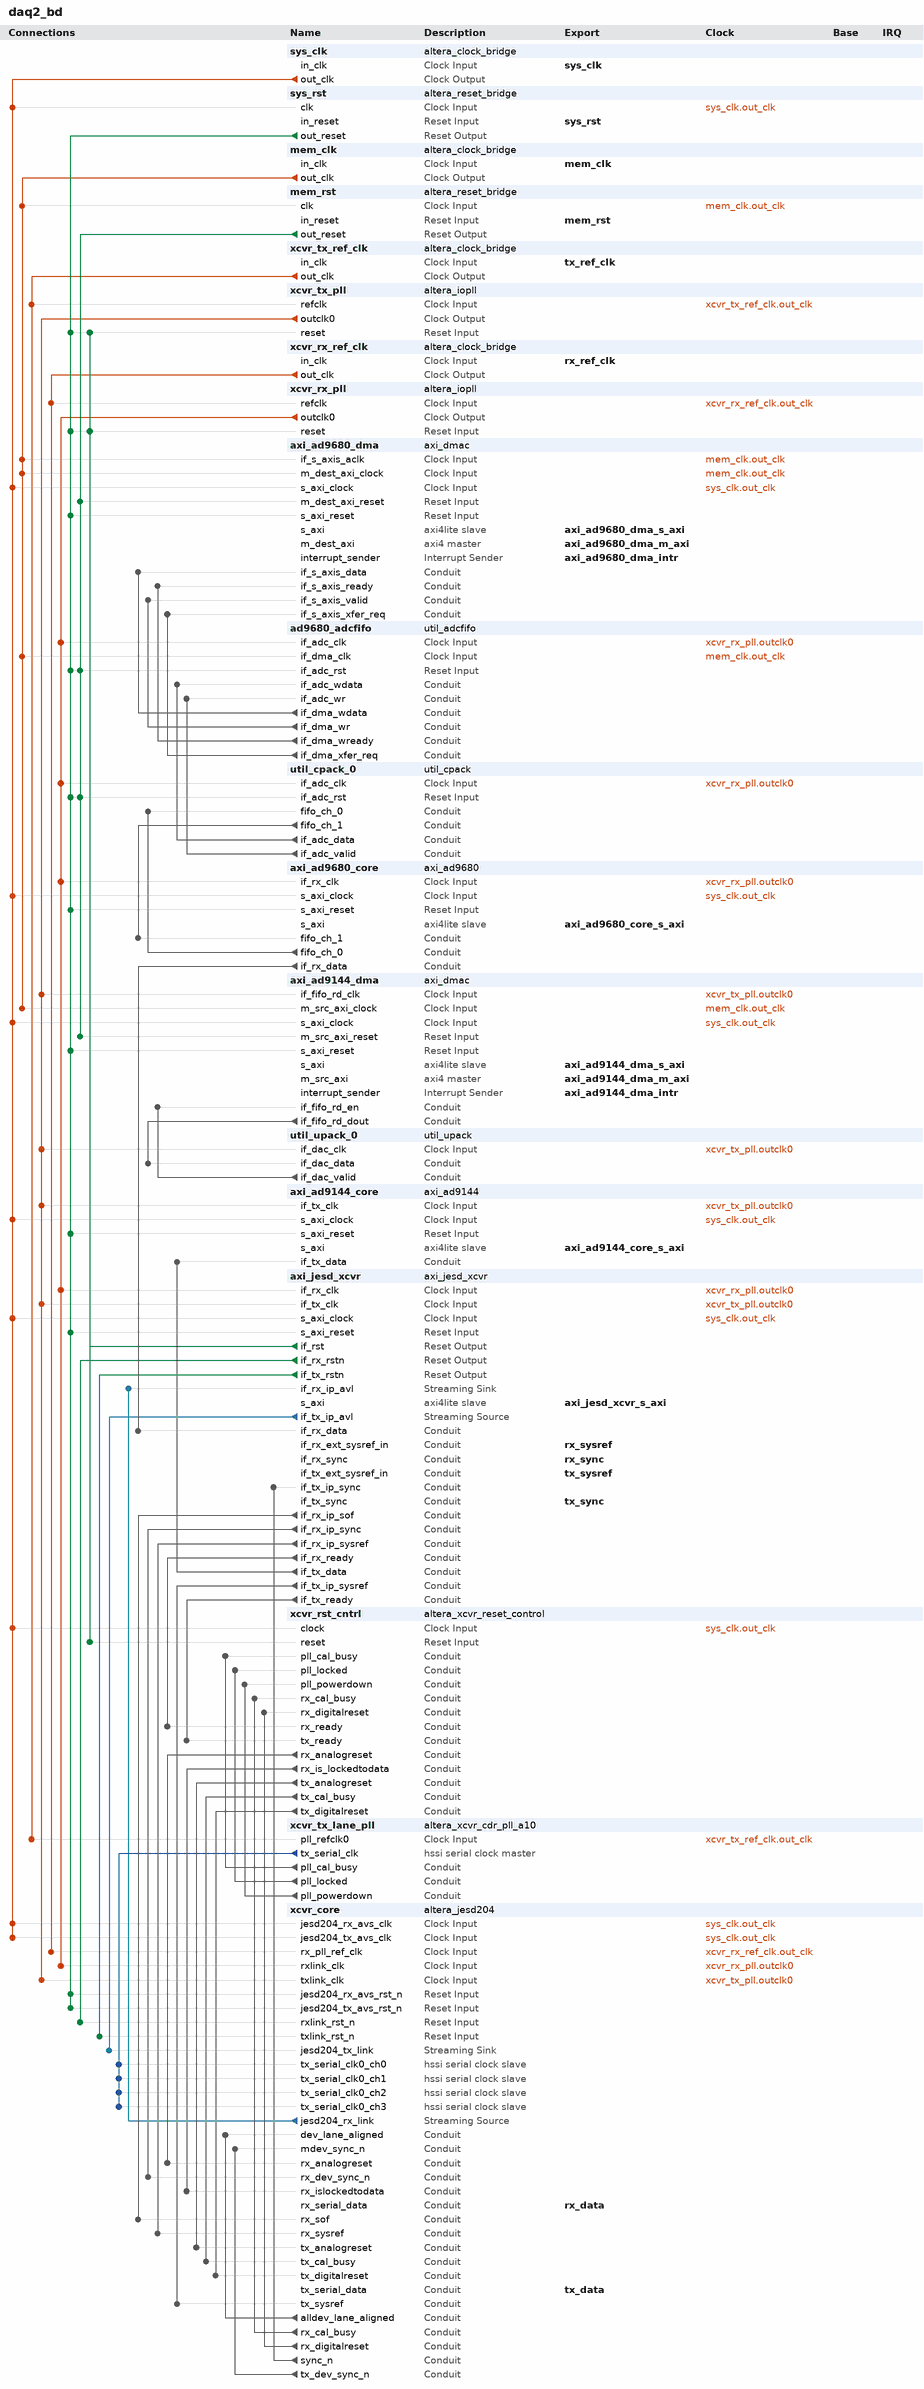
[diagram p0: system contents]
# Platform Designer (Qsys) system daq2_bd, Arria 10 10AX115S2F45I2SG
# Parameters at their usual value, and those the tool derives, are not listed.
package require -exact qsys 15.1
create_system daq2_bd
set_project_property DEVICE_FAMILY {Arria 10}
set_project_property DEVICE 10AX115S2F45I2SG

add_instance sys_clk altera_clock_bridge 15.1
set_instance_parameter_value sys_clk DERIVED_CLOCK_RATE 0
set_instance_parameter_value sys_clk EXPLICIT_CLOCK_RATE 100000000

add_instance sys_rst altera_reset_bridge 15.1
set_instance_parameter_value sys_rst ACTIVE_LOW_RESET 0
set_instance_parameter_value sys_rst SYNCHRONOUS_EDGES deassert

add_instance mem_clk altera_clock_bridge 15.1
set_instance_parameter_value mem_clk DERIVED_CLOCK_RATE 0
set_instance_parameter_value mem_clk EXPLICIT_CLOCK_RATE 125000000

add_instance mem_rst altera_reset_bridge 15.1
set_instance_parameter_value mem_rst ACTIVE_LOW_RESET 0
set_instance_parameter_value mem_rst SYNCHRONOUS_EDGES deassert

add_instance xcvr_tx_ref_clk altera_clock_bridge 15.1
set_instance_parameter_value xcvr_tx_ref_clk DERIVED_CLOCK_RATE 0
set_instance_parameter_value xcvr_tx_ref_clk EXPLICIT_CLOCK_RATE 500000000

add_instance xcvr_tx_pll altera_iopll 15.1
set_instance_parameter_value xcvr_tx_pll gui_actual_duty_cycle0 50.0
set_instance_parameter_value xcvr_tx_pll gui_actual_output_clock_frequency0 100.0
set_instance_parameter_value xcvr_tx_pll gui_actual_phase_shift0 0.0
set_instance_parameter_value xcvr_tx_pll gui_actual_phase_shift_deg0 0.0
set_instance_parameter_value xcvr_tx_pll gui_clock_name_global0 false
set_instance_parameter_value xcvr_tx_pll gui_device_speed_grade 1
set_instance_parameter_value xcvr_tx_pll gui_en_lvds_ports Disabled
set_instance_parameter_value xcvr_tx_pll gui_mif_generate false
set_instance_parameter_value xcvr_tx_pll gui_number_of_clocks 1
set_instance_parameter_value xcvr_tx_pll gui_operation_mode direct
set_instance_parameter_value xcvr_tx_pll gui_output_clock_frequency0 250.0
set_instance_parameter_value xcvr_tx_pll gui_reference_clock_frequency 500.0
set_instance_parameter_value xcvr_tx_pll gui_use_NDFB_modes false
set_instance_parameter_value xcvr_tx_pll gui_use_locked false
set_instance_parameter_value xcvr_tx_pll gui_vco_frequency 600.0
set_instance_parameter_value xcvr_tx_pll system_info_device_component 10AX115S2F45I2SG
set_instance_parameter_value xcvr_tx_pll system_info_device_speed_grade 2
set_instance_parameter_value xcvr_tx_pll system_part_trait_speed_grade 2

add_instance xcvr_rx_ref_clk altera_clock_bridge 15.1
set_instance_parameter_value xcvr_rx_ref_clk DERIVED_CLOCK_RATE 0
set_instance_parameter_value xcvr_rx_ref_clk EXPLICIT_CLOCK_RATE 500000000

add_instance xcvr_rx_pll altera_iopll 15.1
set_instance_parameter_value xcvr_rx_pll gui_actual_duty_cycle0 50.0
set_instance_parameter_value xcvr_rx_pll gui_actual_output_clock_frequency0 100.0
set_instance_parameter_value xcvr_rx_pll gui_actual_phase_shift0 0.0
set_instance_parameter_value xcvr_rx_pll gui_actual_phase_shift_deg0 0.0
set_instance_parameter_value xcvr_rx_pll gui_clock_name_global0 false
set_instance_parameter_value xcvr_rx_pll gui_device_speed_grade 1
set_instance_parameter_value xcvr_rx_pll gui_en_lvds_ports Disabled
set_instance_parameter_value xcvr_rx_pll gui_mif_generate false
set_instance_parameter_value xcvr_rx_pll gui_number_of_clocks 1
set_instance_parameter_value xcvr_rx_pll gui_operation_mode direct
set_instance_parameter_value xcvr_rx_pll gui_output_clock_frequency0 250.0
set_instance_parameter_value xcvr_rx_pll gui_reference_clock_frequency 500.0
set_instance_parameter_value xcvr_rx_pll gui_use_NDFB_modes false
set_instance_parameter_value xcvr_rx_pll gui_use_locked false
set_instance_parameter_value xcvr_rx_pll gui_vco_frequency 600.0
set_instance_parameter_value xcvr_rx_pll system_info_device_component 10AX115S2F45I2SG
set_instance_parameter_value xcvr_rx_pll system_info_device_speed_grade 2
set_instance_parameter_value xcvr_rx_pll system_part_trait_speed_grade 2

add_instance axi_ad9680_dma axi_dmac 1.0
set_instance_parameter_value axi_ad9680_dma ASYNC_CLK_DEST_REQ 1
set_instance_parameter_value axi_ad9680_dma ASYNC_CLK_REQ_SRC 1
set_instance_parameter_value axi_ad9680_dma ASYNC_CLK_SRC_DEST 1
set_instance_parameter_value axi_ad9680_dma AXI_SLICE_DEST 0
set_instance_parameter_value axi_ad9680_dma AXI_SLICE_SRC 0
set_instance_parameter_value axi_ad9680_dma CYCLIC 0
set_instance_parameter_value axi_ad9680_dma DMA_2D_TRANSFER 0
set_instance_parameter_value axi_ad9680_dma DMA_DATA_WIDTH_DEST 128
set_instance_parameter_value axi_ad9680_dma DMA_DATA_WIDTH_SRC 128
set_instance_parameter_value axi_ad9680_dma DMA_LENGTH_WIDTH 24
set_instance_parameter_value axi_ad9680_dma DMA_TYPE_DEST 0
set_instance_parameter_value axi_ad9680_dma DMA_TYPE_SRC 1
set_instance_parameter_value axi_ad9680_dma FIFO_SIZE 4
set_instance_parameter_value axi_ad9680_dma ID 0
set_instance_parameter_value axi_ad9680_dma SYNC_TRANSFER_START 1

add_instance ad9680_adcfifo util_adcfifo 1.0
set_instance_parameter_value ad9680_adcfifo ADC_DATA_WIDTH 128
set_instance_parameter_value ad9680_adcfifo DMA_ADDRESS_WIDTH 16
set_instance_parameter_value ad9680_adcfifo DMA_DATA_WIDTH 128
set_instance_parameter_value ad9680_adcfifo DMA_READY_ENABLE 1

add_instance util_cpack_0 util_cpack 1.0
set_instance_parameter_value util_cpack_0 CHANNEL_DATA_WIDTH 64
set_instance_parameter_value util_cpack_0 NUM_OF_CHANNELS 2

add_instance axi_ad9680_core axi_ad9680 1.0
set_instance_parameter_value axi_ad9680_core ID 0

add_instance axi_ad9144_dma axi_dmac 1.0
set_instance_parameter_value axi_ad9144_dma ASYNC_CLK_DEST_REQ 1
set_instance_parameter_value axi_ad9144_dma ASYNC_CLK_REQ_SRC 1
set_instance_parameter_value axi_ad9144_dma ASYNC_CLK_SRC_DEST 1
set_instance_parameter_value axi_ad9144_dma AXI_SLICE_DEST 0
set_instance_parameter_value axi_ad9144_dma AXI_SLICE_SRC 0
set_instance_parameter_value axi_ad9144_dma CYCLIC 1
set_instance_parameter_value axi_ad9144_dma DMA_2D_TRANSFER 0
set_instance_parameter_value axi_ad9144_dma DMA_DATA_WIDTH_DEST 128
set_instance_parameter_value axi_ad9144_dma DMA_DATA_WIDTH_SRC 128
set_instance_parameter_value axi_ad9144_dma DMA_LENGTH_WIDTH 14
set_instance_parameter_value axi_ad9144_dma DMA_TYPE_DEST 2
set_instance_parameter_value axi_ad9144_dma DMA_TYPE_SRC 0
set_instance_parameter_value axi_ad9144_dma FIFO_SIZE 4
set_instance_parameter_value axi_ad9144_dma ID 0
set_instance_parameter_value axi_ad9144_dma SYNC_TRANSFER_START 0

add_instance util_upack_0 util_upack 1.0
set_instance_parameter_value util_upack_0 CHANNEL_DATA_WIDTH 64
set_instance_parameter_value util_upack_0 NUM_OF_CHANNELS 2

add_instance axi_ad9144_core axi_ad9144 1.0
set_instance_parameter_value axi_ad9144_core ID 0
set_instance_parameter_value axi_ad9144_core QUAD_OR_DUAL_N 0

add_instance axi_jesd_xcvr axi_jesd_xcvr 1.0
set_instance_parameter_value axi_jesd_xcvr DEVICE_TYPE 0
set_instance_parameter_value axi_jesd_xcvr ID 0
set_instance_parameter_value axi_jesd_xcvr RX_NUM_OF_LANES 4
set_instance_parameter_value axi_jesd_xcvr TX_NUM_OF_LANES 4

add_instance xcvr_rst_cntrl altera_xcvr_reset_control 15.1
set_instance_parameter_value xcvr_rst_cntrl CHANNELS 4
set_instance_parameter_value xcvr_rst_cntrl RX_PER_CHANNEL 1
set_instance_parameter_value xcvr_rst_cntrl SYS_CLK_IN_MHZ 100
set_instance_parameter_value xcvr_rst_cntrl TX_PER_CHANNEL 1
set_instance_parameter_value xcvr_rst_cntrl TX_PLL_ENABLE 1
set_instance_parameter_value xcvr_rst_cntrl T_PLL_LOCK_HYST 1000
set_instance_parameter_value xcvr_rst_cntrl T_RX_ANALOGRESET 100000
set_instance_parameter_value xcvr_rst_cntrl T_RX_DIGITALRESET 100000
set_instance_parameter_value xcvr_rst_cntrl T_TX_ANALOGRESET 100000
set_instance_parameter_value xcvr_rst_cntrl T_TX_DIGITALRESET 100000
set_instance_parameter_value xcvr_rst_cntrl gui_pll_cal_busy 1

add_instance xcvr_tx_lane_pll altera_xcvr_cdr_pll_a10 15.1
set_instance_parameter_value xcvr_tx_lane_pll base_device NIGHTFURY5
set_instance_parameter_value xcvr_tx_lane_pll bw_sel Medium
set_instance_parameter_value xcvr_tx_lane_pll cdr_pll_cgb_div 1
set_instance_parameter_value xcvr_tx_lane_pll cdr_pll_initial_settings true
set_instance_parameter_value xcvr_tx_lane_pll cdr_pll_is_cascaded_pll false
set_instance_parameter_value xcvr_tx_lane_pll cdr_pll_optimal false
set_instance_parameter_value xcvr_tx_lane_pll device_family {Arria 10}
set_instance_parameter_value xcvr_tx_lane_pll diag_loopback_enable false
set_instance_parameter_value xcvr_tx_lane_pll enable_analog_resets 0
set_instance_parameter_value xcvr_tx_lane_pll enable_pll_reconfig 0
set_instance_parameter_value xcvr_tx_lane_pll generate_add_hdl_instance_example 0
set_instance_parameter_value xcvr_tx_lane_pll generate_docs 1
set_instance_parameter_value xcvr_tx_lane_pll gui_tx_pll_prot_mode Basic
set_instance_parameter_value xcvr_tx_lane_pll message_level error
set_instance_parameter_value xcvr_tx_lane_pll output_clock_frequency 5000
set_instance_parameter_value xcvr_tx_lane_pll rcfg_debug 0
set_instance_parameter_value xcvr_tx_lane_pll rcfg_enable_avmm_busy_port 0
set_instance_parameter_value xcvr_tx_lane_pll rcfg_file_prefix altera_xcvr_cdr_pll_a10
set_instance_parameter_value xcvr_tx_lane_pll rcfg_h_file_enable 0
set_instance_parameter_value xcvr_tx_lane_pll rcfg_jtag_enable 0
set_instance_parameter_value xcvr_tx_lane_pll rcfg_mif_file_enable 0
set_instance_parameter_value xcvr_tx_lane_pll rcfg_multi_enable 0
set_instance_parameter_value xcvr_tx_lane_pll rcfg_profile_cnt 2
set_instance_parameter_value xcvr_tx_lane_pll rcfg_profile_select 1
set_instance_parameter_value xcvr_tx_lane_pll rcfg_separate_avmm_busy 0
set_instance_parameter_value xcvr_tx_lane_pll rcfg_sv_file_enable 0
set_instance_parameter_value xcvr_tx_lane_pll rcfg_txt_file_enable 0
set_instance_parameter_value xcvr_tx_lane_pll refclk_cnt 1
set_instance_parameter_value xcvr_tx_lane_pll refclk_index 0
set_instance_parameter_value xcvr_tx_lane_pll refclk_select_mux_powerdown_mode powerup
set_instance_parameter_value xcvr_tx_lane_pll reference_clock_frequency 500.0
set_instance_parameter_value xcvr_tx_lane_pll select_manual_config false
set_instance_parameter_value xcvr_tx_lane_pll set_altera_xcvr_cdr_pll_a10_calibration_en 1
set_instance_parameter_value xcvr_tx_lane_pll set_capability_reg_enable 0
set_instance_parameter_value xcvr_tx_lane_pll set_csr_soft_logic_enable 0
set_instance_parameter_value xcvr_tx_lane_pll set_user_identifier 0
set_instance_parameter_value xcvr_tx_lane_pll support_mode user_mode

add_instance xcvr_core altera_jesd204 15.1
set_instance_parameter_value xcvr_core ADJCNT 0
set_instance_parameter_value xcvr_core ADJDIR 0
set_instance_parameter_value xcvr_core BID 0
set_instance_parameter_value xcvr_core CF 0
set_instance_parameter_value xcvr_core CS 0
set_instance_parameter_value xcvr_core DATA_PATH RX_TX
set_instance_parameter_value xcvr_core DID 0
set_instance_parameter_value xcvr_core DLB_TEST 0
set_instance_parameter_value xcvr_core ECC_EN 0
set_instance_parameter_value xcvr_core ED_DEV_KIT NONE
set_instance_parameter_value xcvr_core ED_FILESET_SIM false
set_instance_parameter_value xcvr_core ED_FILESET_SYNTH false
set_instance_parameter_value xcvr_core ED_GENERIC_5SERIES No
set_instance_parameter_value xcvr_core ED_GENERIC_A10 No
set_instance_parameter_value xcvr_core ED_HDL_FORMAT_SIM VERILOG
set_instance_parameter_value xcvr_core ED_HDL_FORMAT_SYNTH VERILOG
set_instance_parameter_value xcvr_core GUI_CFG_F 1
set_instance_parameter_value xcvr_core GUI_EN_CFG_F true
set_instance_parameter_value xcvr_core HD 1
set_instance_parameter_value xcvr_core JESDV 1
set_instance_parameter_value xcvr_core K 32
set_instance_parameter_value xcvr_core L 4
set_instance_parameter_value xcvr_core LID0 0
set_instance_parameter_value xcvr_core LID1 1
set_instance_parameter_value xcvr_core LID2 2
set_instance_parameter_value xcvr_core LID3 3
set_instance_parameter_value xcvr_core LID4 4
set_instance_parameter_value xcvr_core LID5 5
set_instance_parameter_value xcvr_core LID6 6
set_instance_parameter_value xcvr_core LID7 7
set_instance_parameter_value xcvr_core M 2
set_instance_parameter_value xcvr_core N 16
set_instance_parameter_value xcvr_core N_PRIME 16
set_instance_parameter_value xcvr_core OPTIMIZE 0
set_instance_parameter_value xcvr_core PCS_CONFIG JESD_PCS_CFG2
set_instance_parameter_value xcvr_core PHADJ 0
set_instance_parameter_value xcvr_core REFCLK_FREQ 500.0
set_instance_parameter_value xcvr_core RES1 0
set_instance_parameter_value xcvr_core RES2 0
set_instance_parameter_value xcvr_core S 1
set_instance_parameter_value xcvr_core SCR 1
set_instance_parameter_value xcvr_core SUBCLASSV 1
set_instance_parameter_value xcvr_core TERMINATE_RECONFIG_EN false
set_instance_parameter_value xcvr_core TEST_COMPONENTS_EN false
set_instance_parameter_value xcvr_core bitrev_en false
set_instance_parameter_value xcvr_core bonded_mode non_bonded
set_instance_parameter_value xcvr_core lane_rate 10000.0
set_instance_parameter_value xcvr_core part_trait_bd NIGHTFURY5
set_instance_parameter_value xcvr_core part_trait_dp 10AX115S2F45I2SG
set_instance_parameter_value xcvr_core pll_reconfig_enable false
set_instance_parameter_value xcvr_core pll_type CMU
set_instance_parameter_value xcvr_core rcfg_jtag_enable false
set_instance_parameter_value xcvr_core sdc_constraint 1.0
set_instance_parameter_value xcvr_core set_capability_reg_enable false
set_instance_parameter_value xcvr_core set_csr_soft_logic_enable false
set_instance_parameter_value xcvr_core set_prbs_soft_logic_enable false
set_instance_parameter_value xcvr_core set_user_identifier 0
set_instance_parameter_value xcvr_core wrapper_opt base_phy

# connections
add_connection mem_clk.out_clk ad9680_adcfifo.if_dma_clk clock
add_connection mem_clk.out_clk axi_ad9144_dma.m_src_axi_clock clock
add_connection mem_clk.out_clk axi_ad9680_dma.if_s_axis_aclk clock
add_connection mem_clk.out_clk axi_ad9680_dma.m_dest_axi_clock clock
add_connection mem_clk.out_clk mem_rst.clk clock
add_connection sys_clk.out_clk axi_ad9144_core.s_axi_clock clock
add_connection sys_clk.out_clk axi_ad9144_dma.s_axi_clock clock
add_connection sys_clk.out_clk axi_ad9680_core.s_axi_clock clock
add_connection sys_clk.out_clk axi_ad9680_dma.s_axi_clock clock
add_connection sys_clk.out_clk axi_jesd_xcvr.s_axi_clock clock
add_connection sys_clk.out_clk sys_rst.clk clock
add_connection sys_clk.out_clk xcvr_core.jesd204_rx_avs_clk clock
add_connection sys_clk.out_clk xcvr_core.jesd204_tx_avs_clk clock
add_connection sys_clk.out_clk xcvr_rst_cntrl.clock clock
add_connection xcvr_rx_pll.outclk0 ad9680_adcfifo.if_adc_clk clock
add_connection xcvr_rx_pll.outclk0 axi_ad9680_core.if_rx_clk clock
add_connection xcvr_rx_pll.outclk0 axi_jesd_xcvr.if_rx_clk clock
add_connection xcvr_rx_pll.outclk0 util_cpack_0.if_adc_clk clock
add_connection xcvr_rx_pll.outclk0 xcvr_core.rxlink_clk clock
add_connection xcvr_rx_ref_clk.out_clk xcvr_core.rx_pll_ref_clk clock
add_connection xcvr_rx_ref_clk.out_clk xcvr_rx_pll.refclk clock
add_connection xcvr_tx_pll.outclk0 axi_ad9144_core.if_tx_clk clock
add_connection xcvr_tx_pll.outclk0 axi_ad9144_dma.if_fifo_rd_clk clock
add_connection xcvr_tx_pll.outclk0 axi_jesd_xcvr.if_tx_clk clock
add_connection xcvr_tx_pll.outclk0 util_upack_0.if_dac_clk clock
add_connection xcvr_tx_pll.outclk0 xcvr_core.txlink_clk clock
add_connection xcvr_tx_ref_clk.out_clk xcvr_tx_lane_pll.pll_refclk0 clock
add_connection xcvr_tx_ref_clk.out_clk xcvr_tx_pll.refclk clock
add_connection axi_jesd_xcvr.if_rst xcvr_rst_cntrl.reset reset
add_connection axi_jesd_xcvr.if_rst xcvr_rx_pll.reset reset
add_connection axi_jesd_xcvr.if_rst xcvr_tx_pll.reset reset
add_connection axi_jesd_xcvr.if_rx_rstn xcvr_core.rxlink_rst_n reset
add_connection axi_jesd_xcvr.if_tx_rstn xcvr_core.txlink_rst_n reset
add_connection mem_rst.out_reset ad9680_adcfifo.if_adc_rst reset
add_connection mem_rst.out_reset axi_ad9144_dma.m_src_axi_reset reset
add_connection mem_rst.out_reset axi_ad9680_dma.m_dest_axi_reset reset
add_connection mem_rst.out_reset util_cpack_0.if_adc_rst reset
add_connection sys_rst.out_reset ad9680_adcfifo.if_adc_rst reset
add_connection sys_rst.out_reset axi_ad9144_core.s_axi_reset reset
add_connection sys_rst.out_reset axi_ad9144_dma.s_axi_reset reset
add_connection sys_rst.out_reset axi_ad9680_core.s_axi_reset reset
add_connection sys_rst.out_reset axi_ad9680_dma.s_axi_reset reset
add_connection sys_rst.out_reset axi_jesd_xcvr.s_axi_reset reset
add_connection sys_rst.out_reset util_cpack_0.if_adc_rst reset
add_connection sys_rst.out_reset xcvr_core.jesd204_rx_avs_rst_n reset
add_connection sys_rst.out_reset xcvr_core.jesd204_tx_avs_rst_n reset
add_connection sys_rst.out_reset xcvr_rx_pll.reset reset
add_connection sys_rst.out_reset xcvr_tx_pll.reset reset
add_connection axi_jesd_xcvr.if_tx_ip_avl xcvr_core.jesd204_tx_link avalon_streaming
add_connection xcvr_core.jesd204_rx_link axi_jesd_xcvr.if_rx_ip_avl avalon_streaming
add_connection ad9680_adcfifo.if_dma_wdata axi_ad9680_dma.if_s_axis_data conduit
add_connection ad9680_adcfifo.if_dma_wr axi_ad9680_dma.if_s_axis_valid conduit
add_connection ad9680_adcfifo.if_dma_wready axi_ad9680_dma.if_s_axis_ready conduit
add_connection ad9680_adcfifo.if_dma_xfer_req axi_ad9680_dma.if_s_axis_xfer_req conduit
add_connection axi_ad9144_dma.if_fifo_rd_dout util_upack_0.if_dac_data conduit
add_connection axi_ad9680_core.fifo_ch_0 util_cpack_0.fifo_ch_0 conduit
add_connection axi_ad9680_core.if_rx_data axi_jesd_xcvr.if_rx_data conduit
add_connection axi_jesd_xcvr.if_rx_ip_sof xcvr_core.rx_sof conduit
add_connection axi_jesd_xcvr.if_rx_ip_sync xcvr_core.rx_dev_sync_n conduit
add_connection axi_jesd_xcvr.if_rx_ip_sysref xcvr_core.rx_sysref conduit
add_connection axi_jesd_xcvr.if_rx_ready xcvr_rst_cntrl.rx_ready conduit
add_connection axi_jesd_xcvr.if_tx_data axi_ad9144_core.if_tx_data conduit
add_connection axi_jesd_xcvr.if_tx_ip_sysref xcvr_core.tx_sysref conduit
add_connection axi_jesd_xcvr.if_tx_ready xcvr_rst_cntrl.tx_ready conduit
add_connection util_cpack_0.fifo_ch_1 axi_ad9680_core.fifo_ch_1 conduit
add_connection util_cpack_0.if_adc_data ad9680_adcfifo.if_adc_wdata conduit
add_connection util_cpack_0.if_adc_valid ad9680_adcfifo.if_adc_wr conduit
add_connection util_upack_0.if_dac_valid axi_ad9144_dma.if_fifo_rd_en conduit
add_connection xcvr_core.alldev_lane_aligned xcvr_core.dev_lane_aligned conduit
add_connection xcvr_core.rx_cal_busy xcvr_rst_cntrl.rx_cal_busy conduit
add_connection xcvr_core.rx_digitalreset xcvr_rst_cntrl.rx_digitalreset conduit
add_connection xcvr_core.sync_n axi_jesd_xcvr.if_tx_ip_sync conduit
add_connection xcvr_core.tx_dev_sync_n xcvr_core.mdev_sync_n conduit
add_connection xcvr_rst_cntrl.rx_analogreset xcvr_core.rx_analogreset conduit
add_connection xcvr_rst_cntrl.rx_is_lockedtodata xcvr_core.rx_islockedtodata conduit
add_connection xcvr_rst_cntrl.tx_analogreset xcvr_core.tx_analogreset conduit
add_connection xcvr_rst_cntrl.tx_cal_busy xcvr_core.tx_cal_busy conduit
add_connection xcvr_rst_cntrl.tx_digitalreset xcvr_core.tx_digitalreset conduit
add_connection xcvr_tx_lane_pll.pll_cal_busy xcvr_rst_cntrl.pll_cal_busy conduit
add_connection xcvr_tx_lane_pll.pll_locked xcvr_rst_cntrl.pll_locked conduit
add_connection xcvr_tx_lane_pll.pll_powerdown xcvr_rst_cntrl.pll_powerdown conduit
add_connection xcvr_tx_lane_pll.tx_serial_clk xcvr_core.tx_serial_clk0_ch0 hssi_serial_clock
add_connection xcvr_tx_lane_pll.tx_serial_clk xcvr_core.tx_serial_clk0_ch1 hssi_serial_clock
add_connection xcvr_tx_lane_pll.tx_serial_clk xcvr_core.tx_serial_clk0_ch2 hssi_serial_clock
add_connection xcvr_tx_lane_pll.tx_serial_clk xcvr_core.tx_serial_clk0_ch3 hssi_serial_clock

# exported interfaces
add_interface axi_ad9144_core_s_axi axi4lite slave
set_interface_property axi_ad9144_core_s_axi EXPORT_OF axi_ad9144_core.s_axi
add_interface axi_ad9144_dma_intr interrupt sender
set_interface_property axi_ad9144_dma_intr EXPORT_OF axi_ad9144_dma.interrupt_sender
add_interface axi_ad9144_dma_m_axi axi4 master
set_interface_property axi_ad9144_dma_m_axi EXPORT_OF axi_ad9144_dma.m_src_axi
add_interface axi_ad9144_dma_s_axi axi4lite slave
set_interface_property axi_ad9144_dma_s_axi EXPORT_OF axi_ad9144_dma.s_axi
add_interface axi_ad9680_core_s_axi axi4lite slave
set_interface_property axi_ad9680_core_s_axi EXPORT_OF axi_ad9680_core.s_axi
add_interface axi_ad9680_dma_intr interrupt sender
set_interface_property axi_ad9680_dma_intr EXPORT_OF axi_ad9680_dma.interrupt_sender
add_interface axi_ad9680_dma_m_axi axi4 master
set_interface_property axi_ad9680_dma_m_axi EXPORT_OF axi_ad9680_dma.m_dest_axi
add_interface axi_ad9680_dma_s_axi axi4lite slave
set_interface_property axi_ad9680_dma_s_axi EXPORT_OF axi_ad9680_dma.s_axi
add_interface axi_jesd_xcvr_s_axi axi4lite slave
set_interface_property axi_jesd_xcvr_s_axi EXPORT_OF axi_jesd_xcvr.s_axi
add_interface mem_clk clock sink
set_interface_property mem_clk EXPORT_OF mem_clk.in_clk
add_interface mem_rst reset sink
set_interface_property mem_rst EXPORT_OF mem_rst.in_reset
add_interface rx_data conduit end
set_interface_property rx_data EXPORT_OF xcvr_core.rx_serial_data
add_interface rx_ref_clk clock sink
set_interface_property rx_ref_clk EXPORT_OF xcvr_rx_ref_clk.in_clk
add_interface rx_sync conduit end
set_interface_property rx_sync EXPORT_OF axi_jesd_xcvr.if_rx_sync
add_interface rx_sysref conduit end
set_interface_property rx_sysref EXPORT_OF axi_jesd_xcvr.if_rx_ext_sysref_in
add_interface sys_clk clock sink
set_interface_property sys_clk EXPORT_OF sys_clk.in_clk
add_interface sys_rst reset sink
set_interface_property sys_rst EXPORT_OF sys_rst.in_reset
add_interface tx_data conduit end
set_interface_property tx_data EXPORT_OF xcvr_core.tx_serial_data
add_interface tx_ref_clk clock sink
set_interface_property tx_ref_clk EXPORT_OF xcvr_tx_ref_clk.in_clk
add_interface tx_sync conduit end
set_interface_property tx_sync EXPORT_OF axi_jesd_xcvr.if_tx_sync
add_interface tx_sysref conduit end
set_interface_property tx_sysref EXPORT_OF axi_jesd_xcvr.if_tx_ext_sysref_in

set_interconnect_requirement {$system} qsys_mm.clockCrossingAdapter FIFO
set_interconnect_requirement {$system} qsys_mm.insertDefaultSlave false
set_interconnect_requirement {$system} qsys_mm.maxAdditionalLatency 2

save_system daq2_bd.qsys
